# Altium schematic sheet GlassBoard.SchDoc
size A; SheetNumber: 1; SheetTotal: 2
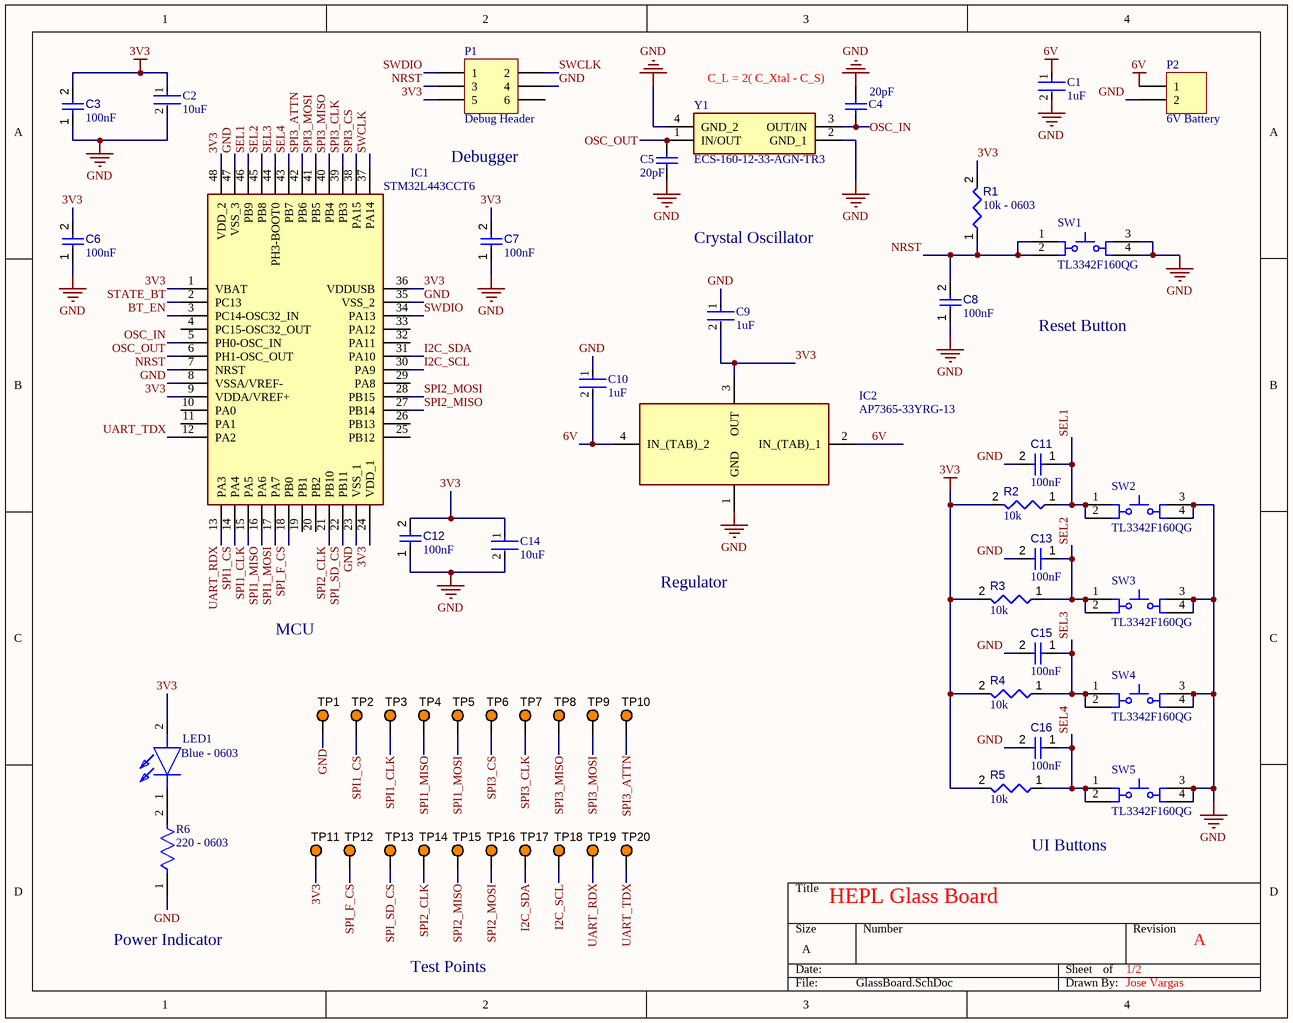
[diagram p0: GlassBoard.SchDoc]

## Parts
C1  1uF  [FP-CC0603-DA-MFG]
C2  10uF  [FP-GRM188-0_1-e0_2_0_55-IPC_A]
C3  value 100nF  [CAPC1608X90X40NL10T20]  (hidden comment: Capacitor 100 nF +/-10% 50 V 0603)
C4  20pF  [CAPC2013X140X50NL20T25]
C5  20pF  [CAPC2013X140X50NL20T25]
C6  value 100nF  [CAPC1608X90X40NL10T20]  (hidden comment: Capacitor 100 nF +/-10% 50 V 0603)
C7  value 100nF  [CAPC1608X90X40NL10T20]  (hidden comment: Capacitor 100 nF +/-10% 50 V 0603)
C8  value 100nF  [CAPC1608X90X40NL10T20]  (hidden comment: Capacitor 100 nF +/-10% 50 V 0603)
C9  1uF  [FP-CC0603-DA-MFG]
C10  1uF  [FP-CC0603-DA-MFG]
C11  value 100nF  [CAPC1608X90X40NL10T20]  (hidden comment: Capacitor 100 nF +/-10% 50 V 0603)
C12  value 100nF  [CAPC1608X90X40NL10T20]  (hidden comment: Capacitor 100 nF +/-10% 50 V 0603)
C13  value 100nF  [CAPC1608X90X40NL10T20]  (hidden comment: Capacitor 100 nF +/-10% 50 V 0603)
C14  10uF  [FP-GRM188-0_1-e0_2_0_55-IPC_A]
C15  value 100nF  [CAPC1608X90X40NL10T20]  (hidden comment: Capacitor 100 nF +/-10% 50 V 0603)
C16  value 100nF  [CAPC1608X90X40NL10T20]  (hidden comment: Capacitor 100 nF +/-10% 50 V 0603)
IC1  STM32L443CCT6  [QFP50P900X900X160-48N]
IC2  AP7365-33YRG-13  [AP736533YRG13]
LED1  Blue - 0603  [155060BS75300]
P1  Debug Header  [HDR2X3]
P2  6V Battery  [HDR1X2]
R1  value 10k - 0603  [RESC1608X55X25ML10T15]  (hidden comment: Resistor 10k +/-1% 0603 100 mW)
R2  value 10k  [RESC1608X55X25ML10T15]  (hidden comment: Resistor 10k +/-1% 0603 100 mW)
R3  value 10k  [RESC1608X55X25ML10T15]  (hidden comment: Resistor 10k +/-1% 0603 100 mW)
R4  value 10k  [RESC1608X55X25ML10T15]  (hidden comment: Resistor 10k +/-1% 0603 100 mW)
R5  value 10k  [RESC1608X55X25ML10T15]  (hidden comment: Resistor 10k +/-1% 0603 100 mW)
R6  220 - 0603  [FP-CRCW0603-e3-MFG]
SW1  TL3342F160QG  [ESWI-TL3342F160QG_V]
SW2  TL3342F160QG  [ESWI-TL3342F160QG_V]
SW3  TL3342F160QG  [ESWI-TL3342F160QG_V]
SW4  TL3342F160QG  [ESWI-TL3342F160QG_V]
SW5  TL3342F160QG  [ESWI-TL3342F160QG_V]
TP1  5003  [KSTN-5003]  (value not drawn)
TP2  5003  [KSTN-5003]  (value not drawn)
TP3  5003  [KSTN-5003]  (value not drawn)
TP4  5003  [KSTN-5003]  (value not drawn)
TP5  5003  [KSTN-5003]  (value not drawn)
TP6  5003  [KSTN-5003]  (value not drawn)
TP7  5003  [KSTN-5003]  (value not drawn)
TP8  5003  [KSTN-5003]  (value not drawn)
TP9  5003  [KSTN-5003]  (value not drawn)
TP10  5003  [KSTN-5003]  (value not drawn)
TP11  5003  [KSTN-5003]  (value not drawn)
TP12  5003  [KSTN-5003]  (value not drawn)
TP13  5003  [KSTN-5003]  (value not drawn)
TP14  5003  [KSTN-5003]  (value not drawn)
TP15  5003  [KSTN-5003]  (value not drawn)
TP16  5003  [KSTN-5003]  (value not drawn)
TP17  5003  [KSTN-5003]  (value not drawn)
TP18  5003  [KSTN-5003]  (value not drawn)
TP19  5003  [KSTN-5003]  (value not drawn)
TP20  5003  [KSTN-5003]  (value not drawn)
Y1  ECS-160-12-33-AGN-TR3  [ECS1601233AGNTR3]

## Nets
3V3: C2.1 C3.2 C6.2 C7.2 C9.2 C12.2 C14.1 IC1.1(VBAT) IC1.9(VDDA/VREF+) IC1.24(VDD_1) IC1.36(VDDUSB) IC1.48(VDD_2) IC2.3(OUT) LED1.2(A) P1.5 R1.2 R2.2 R3.2 R4.2 R5.2 TP11.1
6V: C1.1 C10.2 IC2.2(IN_(TAB)_1) IC2.4(IN_(TAB)_2) P2.1
GND: C1.2 C2.2 C3.1 C4.2 C5.1 C6.1 C7.1 C8.1 C9.1 C10.1 C11.2 C12.1 C13.2 C14.2 C15.2 C16.2 IC1.8(VSSA/VREF-) IC1.23(VSS_1) IC1.35(VSS_2) IC1.47(VSS_3) IC2.1(GND) P1.4 P2.2 R6.1 SW1.3 SW1.4 SW2.3 SW2.4 SW3.3 SW3.4 SW4.3 SW4.4 SW5.3 SW5.4 TP1.1 Y1.2(GND_1) Y1.4(GND_2)
BT_EN: IC1.3(PC14-OSC32_IN)
I2C_SCL: IC1.30(PA9) TP18.1
I2C_SDA: IC1.31(PA10) TP17.1
NRST: C8.2 IC1.7(NRST) P1.3 R1.1 SW1.1 SW1.2
OSC_IN: C4.1 IC1.5(PH0-OSC_IN) Y1.3(OUT/IN)
OSC_OUT: C5.2 IC1.6(PH1-OSC_OUT) Y1.1(IN/OUT)
SEL1: C11.1 IC1.46(PB9) R2.1 SW2.1 SW2.2
SEL2: C13.1 IC1.45(PB8) R3.1 SW3.1 SW3.2
SEL3: C15.1 IC1.44(PH3-BOOT0) R4.1 SW4.1 SW4.2
SEL4: C16.1 IC1.43(PB7) R5.1 SW5.1 SW5.2
SPI1_CLK: IC1.15(PA5) TP3.1
SPI1_CS: IC1.14(PA4) TP2.1
SPI1_MISO: IC1.16(PA6) TP4.1
SPI1_MOSI: IC1.17(PA7) TP5.1
SPI2_CLK: IC1.21(PB10) TP14.1
SPI2_MISO: IC1.27(PB14) TP15.1
SPI2_MOSI: IC1.28(PB15) TP16.1
SPI3_ATTN: IC1.42(PB6) TP10.1
SPI3_CLK: IC1.39(PB3) TP7.1
SPI3_CS: IC1.38(PA15) TP6.1
SPI3_MISO: IC1.40(PB4) TP8.1
SPI3_MOSI: IC1.41(PB5) TP9.1
SPI_F_CS: IC1.18(PB0) TP12.1
SPI_SD_CS: IC1.22(PB11) TP13.1
STATE_BT: IC1.2(PC13)
SWCLK: IC1.37(PA14) P1.2
SWDIO: IC1.34(PA13) P1.1
UART_RDX: IC1.13(PA3) TP19.1
UART_TDX: IC1.12(PA2) TP20.1
NetLED1_1: LED1.1(K) R6.2

Not connected (* = marked no-connect by the designer): IC1 4(PC15-OSC32_OUT) 10(PA0) 11(PA1) 19(PB1) 20(PB2) 25(PB12) 26(PB13) 29(PA8) 32(PA11) 33(PA12); P1 6

## Notes on the sheet
- (near C4) C_L = 2( C_Xtal - C_S)
- Debugger
- Crystal Oscillator
- Reset Button
- MCU
- Regulator
- HEPL Glass Board
- UI Buttons
- Power Indicator
- Test Points
- 1/2
- A
- Jose Vargas

## Library data of the parts
C1 C9 C10 = CMP-03422-000924-1: CAP CER 1UF 16V X7R 0603; Manufacturer: YAGEO; Manufacturer Part Number: CC0603KRX7R7BB105; Tolerance: 0.1; Temperature Coefficient: 15%; Material: Ceramic; Package: CC0603-DA; RoHS: TRUE; Device Class L2: Capacitors; Temperature Characteristic: X7R; Temperature: -55°C to +125°C; Temperature Range Low: -55°C; Automotive: No; ComponentLink2Description: Datasheet; Value: 1 uF; Lead Free: Yes; Capacitance: 1 uF; ComponentLink2URL: http://www.yageo.com/documents/recent/UPY-GPHC_X7R_6.3V-to-50V_18.pdf; Device Class L1: Passive Components; Voltage: 16 V; Octopart: https://octopart.com/cc0603krx7r7bb105-yageo-42271928; Category: Cap; Digikey Description: CAP CER 1UF 16V X7R 0603; Footprint Url: http://www.yageo.com/exep/pages/download/literatures/UPY-C_GEN_24.pdf; Height: 0.9mm; Voltage Rating: 16 V; Temperature Range High: +125°C; Mouser Description: Multilayer Ceramic Capacitor, CC Series, 1 - F, - 10%, X7R, 16 V, 0603 [1608 Metric]; Device Class L3: Ceramic Capacitors
C2 C14 = CMP-2006-02792-2: Chip Multilayer Ceramic Capacitors for General Purpose, 0603, 10uF, X5R, 15%, 20%, 6.3V; Packaging: Tape and Reel; Voltage Rating (DC): 6.3V; Width: 0.031inch; Termination: SMD/SMT; Dielectric: X5R; Package Quantity: 4000; Voltage Rating: 6.3V; Capacitance: 10uF; Case/Package: 0603; Min Operating Temperature: -55°C; Voltage: 6.3V; Length: 1.6mm; Thickness: 0.035inch; Lead Free: Lead Free; Depth: 0.8mm; Case Code (Imperial): 0603; Max Operating Temperature: 85°C; Material: Ceramic; Height: 0.8mm; Tolerance: 20%; Mount: Surface Mount; REACH SVHC: No SVHC; Radiation Hardening: No; Case Code (Metric): 1608
C3 C6-C8 C11-C13 C15 C16 = CMP-001-00017-6: Chip Capacitor, 100 nF, +/- 10%, 50 V, 0603 (1608 Metric); Voltage Rating: 50V; Capacitor Type: Ceramic; Tolerance: 10%; Mounting Technology: SM; Max Operating Temperature: 125°C; RoHS Compliant: True; Pins: 2; Case/Package: 0603; Min Operating Temperature: -55°C
C4 C5 = CMP-2007-04537-1: Part Number: 08051A200JAT2A; Manufacturer: AVX Interconnect / Elco
IC1 = STM32L443CCT6: Integrated Circuit; Manufacturer_Name: STMicroelectronics; Datasheet Link: https://componentsearchengine.com/Datasheets/2/STM32L443CCT6.pdf; Height: 1.6mm; Manufacturer_Part_Number: STM32L443CCT6; Mouser Part Number: 511-STM32L443CCT6; Mouser Price/Stock: https://www.mouser.co.uk/ProductDetail/STMicroelectronics/STM32L443CCT6?qs=dTJS0cRn7ohLPtZ3IeJ%2Fbg%3D%3D; Arrow Part Number: STM32L443CCT6; Arrow Price/Stock: https://www.arrow.com/en/products/stm32l443cct6/stmicroelectronics?region=nac
IC2 = AP7365-33YRG-13: Integrated Circuit; Manufacturer_Name: Diodes Inc.; Datasheet Link: https://componentsearchengine.com//AP7365-33YRG-13.pdf; Height: 1.6mm; Manufacturer_Part_Number: AP7365-33YRG-13; Mouser Part Number: 621-AP7365-33YRG-13; Mouser Price/Stock: https://www.mouser.co.uk/ProductDetail/Diodes-Incorporated/AP7365-33YRG-13?qs=abZ1nkZpTuM6iU77d8ddPA%3D%3D
LED1 = 155060BS75300: LED; Manufacturer_Name: Wurth Elektronik; Datasheet Link: https://www.mouser.fr/datasheet/2/445/155060BS75300-1838907.pdf; Height: 1mm; Manufacturer_Part_Number: 155060BS75300; Mouser Part Number: 710-155060BS75300; Mouser Price/Stock: https://www.mouser.co.uk/ProductDetail/Wurth-Elektronik/155060BS75300?qs=GedFDFLaBXFE8klTFAyuFA%3D%3D
P1 = Header 3X2: Header, 3-Pin, Dual row; LatestRevisionDate: 17-Jul-2002; LatestRevisionNote: Re-released for DXP Platform.; Publisher: Altium Limited
P2 = Header 2: Header, 2-Pin; LatestRevisionDate: 17-Jul-2002; LatestRevisionNote: Re-released for DXP Platform.; Publisher: Altium Limited
R1-R5 = CMP-009-00017-5: Chip Resistor, 10 KOhm, +/- 1%, 01 W, -55 to 155 degC, 0603 (1608 Metric); Voltage Rating: 50V; Power: 100mW; RoHS Compliant: True; Min Operating Temperature: -55°C; Pins: 2; Case/Package: 0603; Mounting Technology: SM; Max Operating Temperature: 155°C; Tolerance: 1%
R6 = CMP-2000-03085-2: RES Thick Film, 220Ω, 1%, 0.1W, 100ppm/°C, 0603; Power Rating: 100mW; Voltage Rating: 75V; Resistance: 220R; Contact Plating: Tin; Package Quantity: 10; Lead Free: Lead Free; Packaging: Tape and Reel; Max Operating Temperature: 155°C; Case/Package: 0603; Radiation Hardening: No; Height: 0.45mm; Width: 0.033inch; Case Code (Imperial): 0603; Number of Terminations: 2; Tolerance: 1%; Min Operating Temperature: -55°C; Termination: SMD/SMT; Length: 1.55mm; Features: Automotive AEC-Q200; Voltage Rating (DC): 75V; Case Code (Metric): 1608; Composition: Thick Film; Military Standard: Not; Temperature Coefficient: 100ppm/°C; Depth: 0.85mm; Weight: 7.1E-05oz; Max Power Dissipation: 100mW
SW1-SW5 = CMP-011-00008-2: Tactile Switch, SPST-NO, 50 mA, 12 V, 4-Pin SMD, RoHS, Tape and Reel; Manufacturer: E-Switch; Operating Force: 1.6N; Current Rating: 50mA; Throw Configuration: SPST; Max Voltage Rating (DC): 12V; Datasheet URL: http://spec_sheets.e-switch.com/specs/P010632.pdf; Manufacturer URL: http://www.e-switch.ch/en/; Mounting Technology: SM; Case/Package: TL3342F160QG; Package Quantity: 3000; Contact Material: Silver; Package Description: 4-Pin Surface Mount Device, Body 5 x 5 mm, Pitch 6.3 mm; Package Reference: TL3342F160QG; Datasheet Version: Rev. I, 12/2010; Voltage Rating (DC): 12V; Contact Plating: Silver; RoHS Compliant: True; Packaging: TapeandReel
TP1-TP20 = CMP-002-00037-2: Test Point, Orange, Height 4.6 mm, Tail Length 3 mm, 1-Pin THD, RoHS; Manufacturer: Keystone; Colour: Orange; Packaging: Bulk; Package Description: 1-Pin Through Hole Device, Dia 2.54 mm; Pins: 1; Package Reference: 5003; Datasheet Version: Jun-15; Case/Package: 5003; Mounting Technology: TH; Connector Type: TestPoint; Diameter: 2.54mm; Contact Material: Bronze; Datasheet URL: http://keyelco.com/userAssets/file/M65p56.pdf; Manufacturer URL: http://www.keyelco.com/; Package Quantity: 10; Contact Plating: Tin; RoHS Compliant: True
Y1 = ECS-160-12-33-AGN-TR3: Crystal or Oscillator; Manufacturer_Name: ECS; Datasheet Link: https://ecsxtal.com/store/pdf/ecx-32.pdf; Height: 0.8mm; Manufacturer_Part_Number: ECS-160-12-33-AGN-TR3; Mouser Part Number: 520-160-12-33AGN-TR3; Mouser Price/Stock: https://www.mouser.co.uk/ProductDetail/ECS/ECS-160-12-33-AGN-TR3?qs=e8oIoAS2J1R5dXUdgVaN0g%3D%3D; Arrow Part Number: ECS-160-12-33-AGN-TR3; Arrow Price/Stock: https://www.arrow.com/en/products/ecs-160-12-33-agn-tr3/ecs-international?region=nac